# Altium schematic sheet USB.schdoc: TEBF0808 - USB
size A4; DocumentNumber: TEBF0808; Revision: 04; SheetNumber: 14; SheetTotal: 36; Date: 2016-09-29; CompanyName: Trenz Electronic GmbH; Organization: Trenz Electronic GmbH
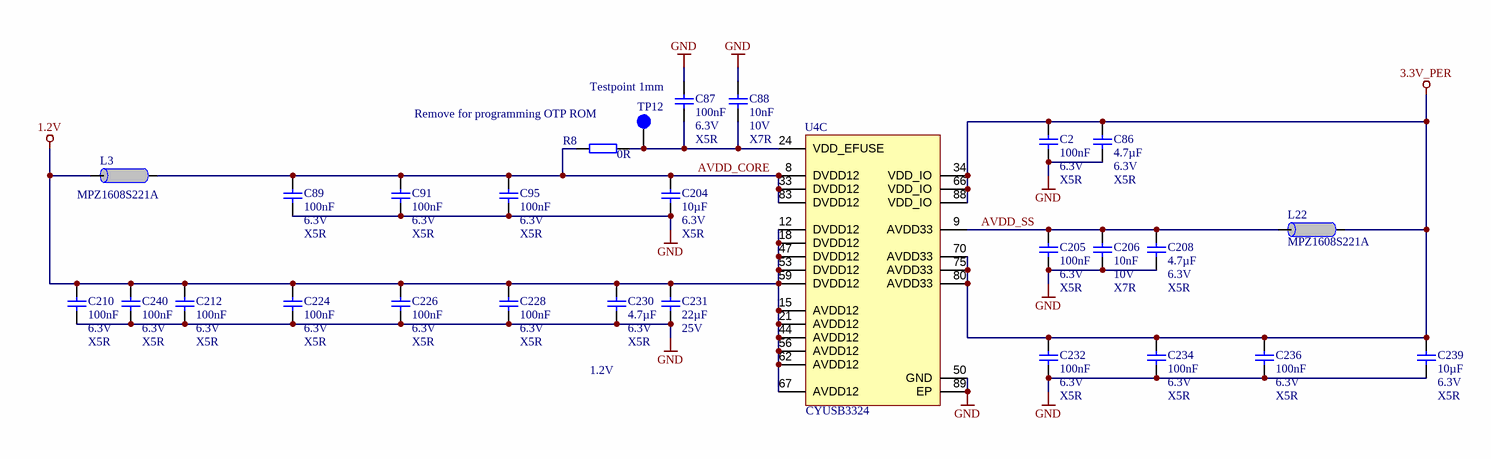
[diagram p0: USB.schdoc]

## Parts
C2  100nF  Voltage: 6.3V  Technology: X5R  [CAPC0603X33N]
C86  4.7µF  Voltage: 6.3V  Technology: X5R  [CAPC1005X60N]
C87  100nF  Voltage: 6.3V  Technology: X5R  [CAPC0603X33N]
C88  10nF  Voltage: 10V  Technology: X7R  [CAPC0603X33N]
C89  100nF  Voltage: 6.3V  Technology: X5R  [CAPC0603X33N]
C91  100nF  Voltage: 6.3V  Technology: X5R  [CAPC0603X33N]
C95  100nF  Voltage: 6.3V  Technology: X5R  [CAPC0603X33N]
C204  10µF  Voltage: 6.3V  Technology: X5R  [CAPC1608X90N]
C205  100nF  Voltage: 6.3V  Technology: X5R  [CAPC0603X33N]
C206  10nF  Voltage: 10V  Technology: X7R  [CAPC0603X33N]
C208  4.7µF  Voltage: 6.3V  Technology: X5R  [CAPC1005X60N]
C210  100nF  Voltage: 6.3V  Technology: X5R  [CAPC0603X33N]
C212  100nF  Voltage: 6.3V  Technology: X5R  [CAPC0603X33N]
C224  100nF  Voltage: 6.3V  Technology: X5R  [CAPC0603X33N]
C226  100nF  Voltage: 6.3V  Technology: X5R  [CAPC0603X33N]
C228  100nF  Voltage: 6.3V  Technology: X5R  [CAPC0603X33N]
C230  4.7µF  Voltage: 6.3V  Technology: X5R  [CAPC1005X60N]
C231  22µF  Voltage: 25V  [CAPC3216X180N]
C232  100nF  Voltage: 6.3V  Technology: X5R  [CAPC0603X33N]
C234  100nF  Voltage: 6.3V  Technology: X5R  [CAPC0603X33N]
C236  100nF  Voltage: 6.3V  Technology: X5R  [CAPC0603X33N]
C239  10µF  Voltage: 6.3V  Technology: X5R  [CAPC1608X90N]
C240  100nF  Voltage: 6.3V  Technology: X5R  [CAPC0603X33N]
L3  MPZ1608S221A  [INDC1608X95N]
L22  MPZ1608S221A  [INDC1608X95N]
R8  0R  [RESC1005X40N]
TP12  Testpoint 1mm  [TP_1mm]
U4  CYUSB3324  [QFN40P10X10X1-89T530]  (part C of 3)

## Nets
1.2V: C210.2 C212.2 C224.2 C226.2 C228.2 C230.1 C231.2 C240.2 L3.2 U4.12(DVDD12) U4.15(AVDD12) U4.18(DVDD12) U4.21(AVDD12) U4.44(AVDD12) U4.47(DVDD12) U4.53(DVDD12) U4.56(AVDD12) U4.59(DVDD12) U4.62(AVDD12) U4.67(AVDD12)
3.3V_PER: C2.1 C86.2 C232.2 C234.2 C236.2 C239.1 L22.1 U4.34(VDD_IO) U4.66(VDD_IO) U4.70(AVDD33) U4.75(AVDD33) U4.80(AVDD33) U4.88(VDD_IO)
GND: C2.2 C86.1 C87.2 C88.2 C89.1 C91.1 C95.1 C204.2 C205.2 C206.2 C208.1 C210.1 C212.1 C224.1 C226.1 C228.1 C230.2 C231.1 C232.1 C234.1 C236.1 C239.2 C240.1 U4.50(GND) U4.89(EP)
AVDD_CORE: C89.2 C91.2 C95.2 C204.1 L3.1 R8.2 U4.8(DVDD12) U4.33(DVDD12) U4.83(DVDD12)
AVDD_SS: C205.1 C206.1 C208.2 L22.2 U4.9(AVDD33)
NetC87_1: C87.1 C88.1 R8.1 TP12.1 U4.24(VDD_EFUSE)

## Notes on the sheet
- (near R8) Remove for programming OTP ROM
- 1.2V
- Title:
- Number:
- Rev.
- Date:
- A4
- Copyright:
- Page
- of
- Filename:

## Library data of the parts
C2 C87 C89 C91 C95 C205 C210 C212 C224 C226 C228 C232 C234 C236 C240 = 24915: KON 100nF 6.3V X5R SMD 10%; AN: 24915; Mixed: SMT; Value: 100n; Preferred: Yes; Case: 0603 (0201); Tolerance: 10%
C86 C208 C230 = 24719: KON 4.7µF 6.3V X5R SMD 20%; AN: 24719; Mixed: SMT; Value: 4.7u; Preferred: Yes; Case: 1005 (0402); Tolerance: 20%
C88 C206 = 26312: KON 10nF X7R 10V SMD 10%; AN: 26312; Mixed: SMT; Value: 10n; Preferred: Yes; Case: 0603 (0201); Tolerance: 10%
C204 C239 = 22918: KON 10µF 6,3V X5R SMD; AN: 22918; Mixed: SMT; Value: 10u; Case: 1608 (0603)
C231 = 24886: KON 22µF X5R 25V SMD 10%; AN: 24886; Value: 22u; Mixed: SMT; Preferred: Yes; Case: 3216 (1206); Tolerance: 10%
L3 L22 = 22718: Ferritdurchführung MPZ1608S221A; AN: 22718; Mixed: SMT; Trenz-Stock: Yes; Value: 220 OHm @ 100MHz; Case: 1608 (0603); HelpURL: B:\AD\adlib\datasheet\MPZ1608; Preferred: Yes; H-ART: MPZ1608S221A
R8 = 22738: WID SMD 0R; AN: 22738; Tolerance: 1%; Mixed: SMT; Value: 0; Preferred: Yes; Case: 1005 (0402); Technology: TK100
TP12 = 25063: AN: 25063; Mixed: SMT
U4 = 27573: CYUSB3324-88LTXC USB 3.0 Hub; AN: 27573; Mixed: SMT; Case: QFN88; HelpURL: b:\AD\adlib\datasheet\CYUSBx30x\; H-ART: CYUSB3324-88LTXC